# EAGLE design CameraSliderV1 (EAGLE 7.3.0)
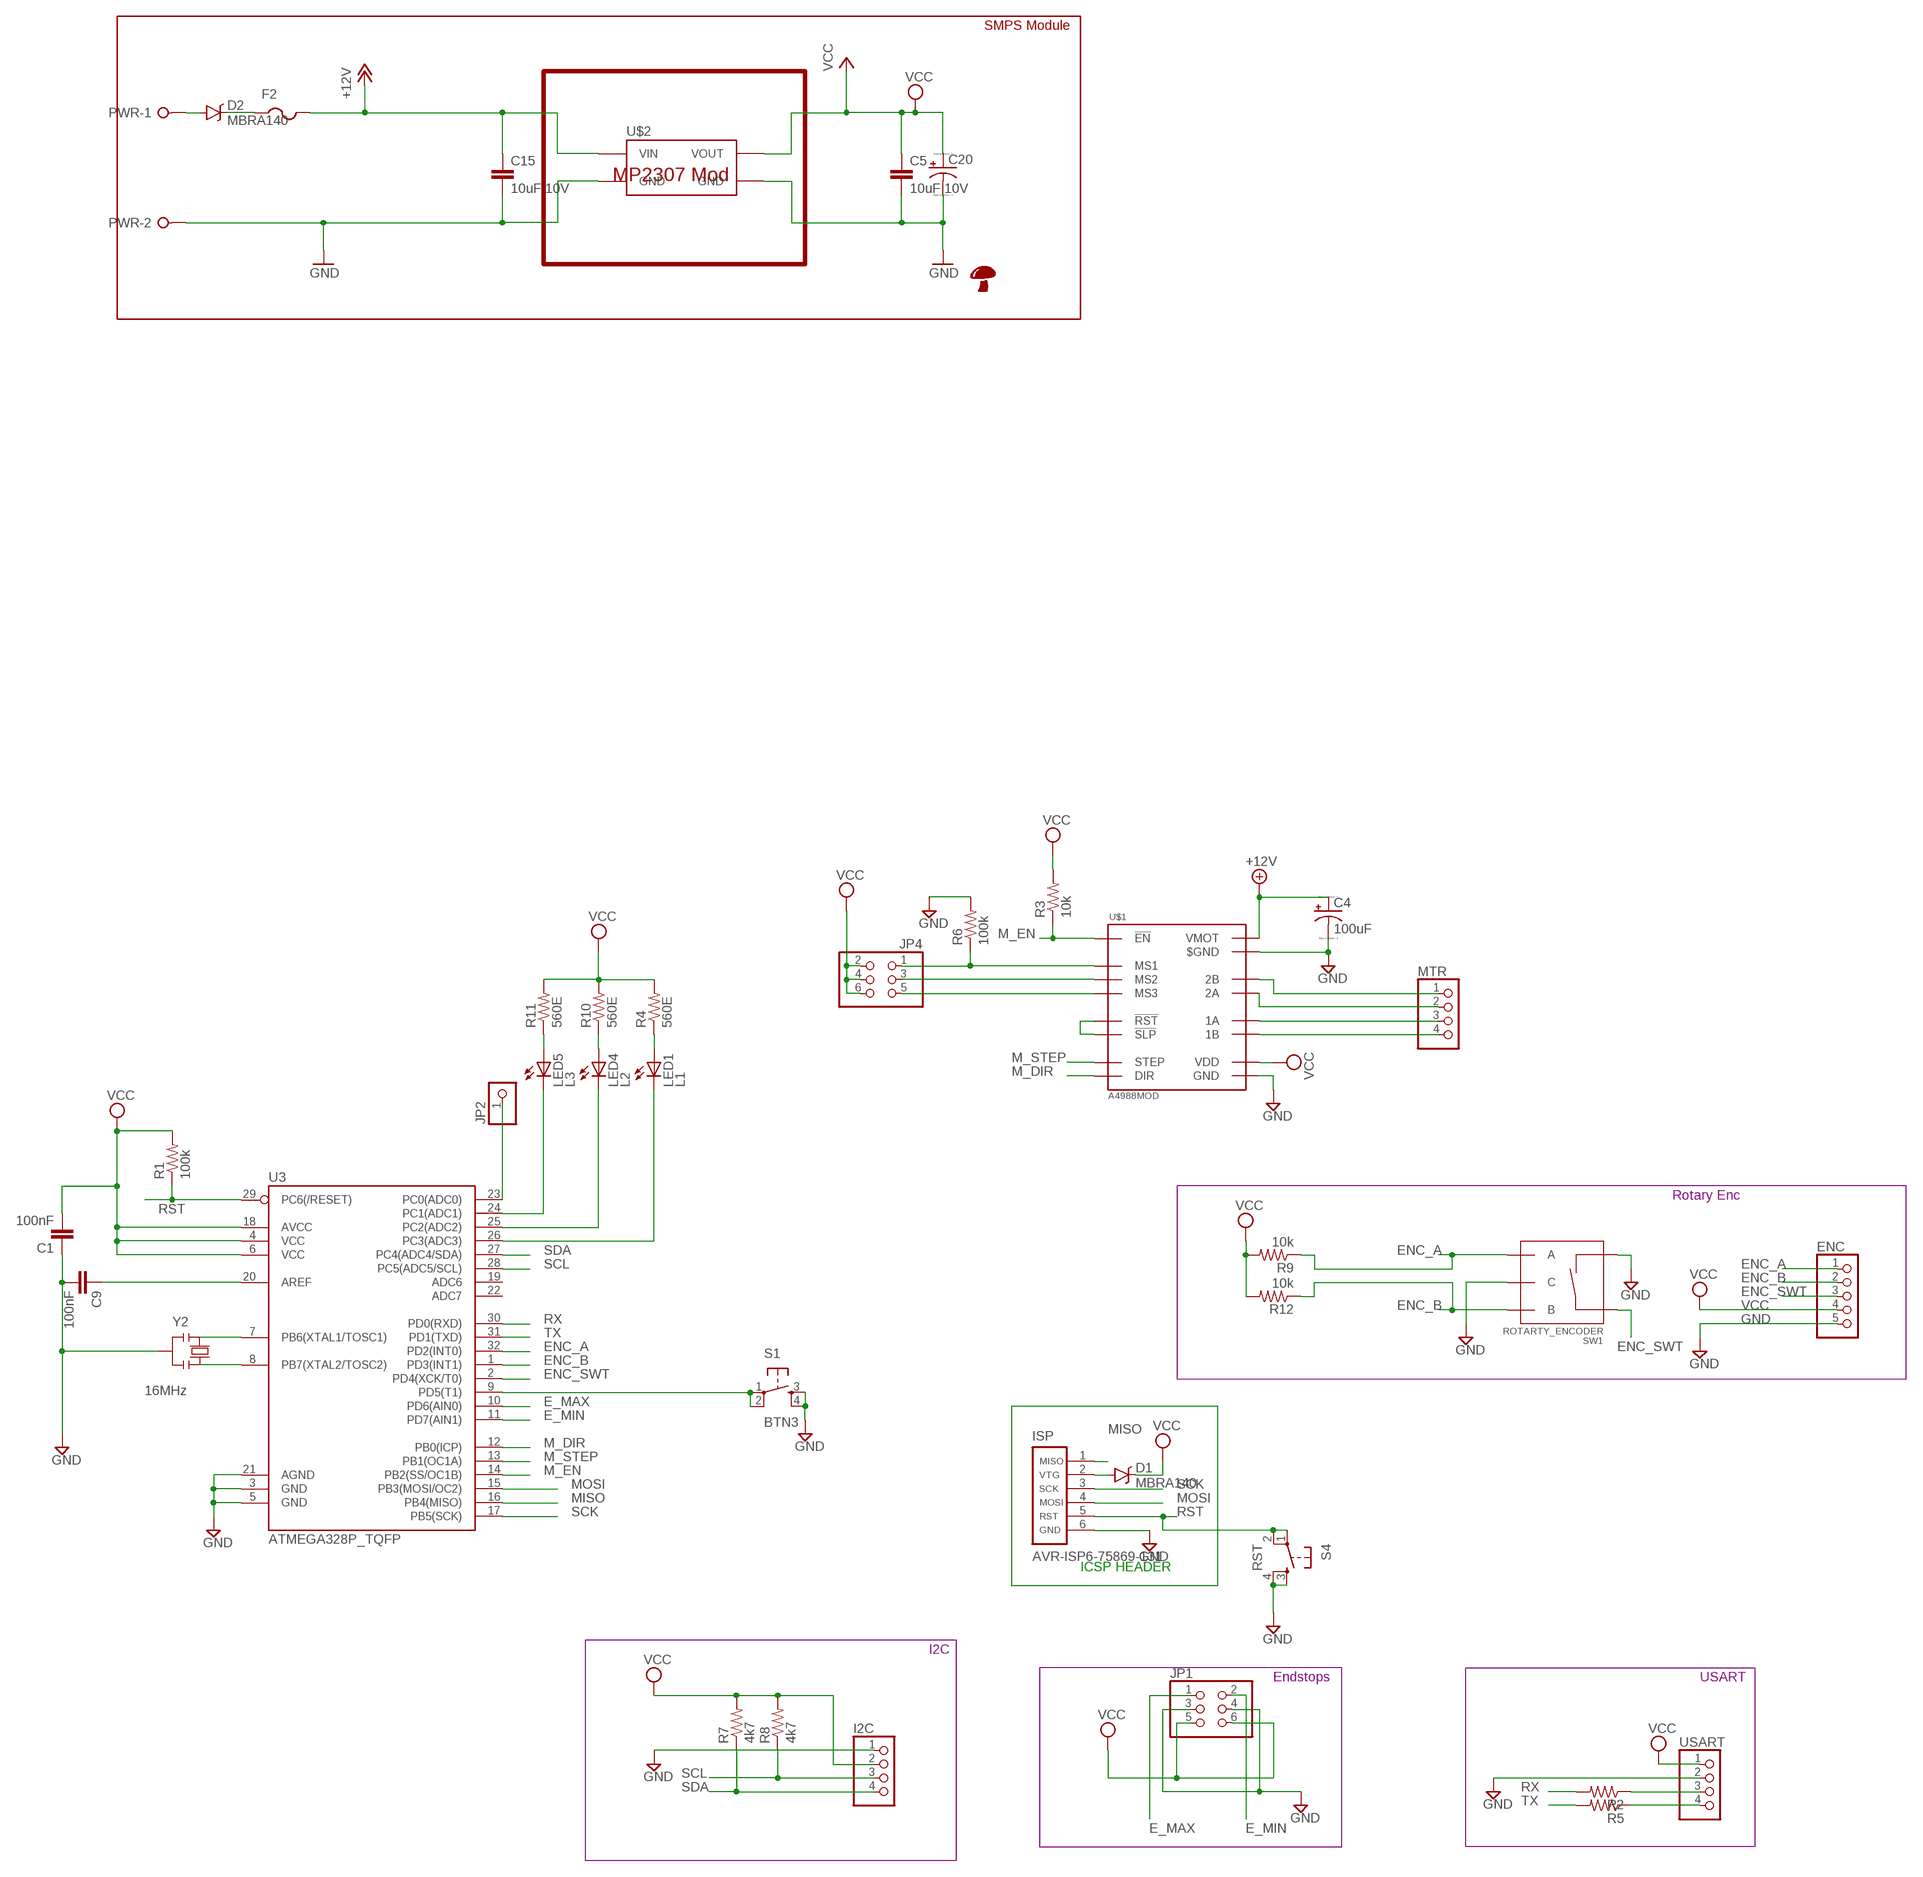
[diagram p0: schematic, sheet 1]

## Parts
C1  100nF  C-EUC0805  [C0805]
C4  100uF  CPOL-USD  [PANASONIC_D]
C5  10uF 10V  C-EUC0805  [C0805]
C9  100nF  C-EUC0805  [C0805]
C15  10uF 10V  C-EUC0805  [C0805]
C20  CPOL-USD  [PANASONIC_D]
D1  MBRA140  [SMA-DIODE]
D2  MBRA140  [SMA-DIODE]
ENC  PINHD-1X5  [1X05]
F2  PTCFUSE-1812  [1812]
I2C  PINHD-1X4  [1X04]
ISP  AVR-ISP6-75869-131  [HDR-75869-131]
JP1  PINHD-2X3  [2X03]
JP2  PINHD-1X1  [1X01]
JP4  PINHD-2X3  [2X03]
LED1  L1  LEDCHIP-LED0805  [CHIP-LED0805]
LED4  L2  LEDCHIP-LED0805  [CHIP-LED0805]
LED5  L3  LEDCHIP-LED0805  [CHIP-LED0805]
MTR  PINHD-1X4  [1X04]
PWR  W237-02P  [W237-132]
R1  100k  R-US_M0805  [M0805]
R2  R-US_M0805  [M0805]
R3  10k  R-US_M0805  [M0805]
R4  560E  R-US_M0805  [M0805]
R5  R-US_M0805  [M0805]
R6  100k  R-US_M0805  [M0805]
R7  4k7  R-US_M0805  [M0805]
R8  4k7  R-US_M0805  [M0805]
R9  10k  R-US_M0805  [M0805]
R10  560E  R-US_M0805  [M0805]
R11  560E  R-US_M0805  [M0805]
R12  10k  R-US_M0805  [M0805]
S1  BTN3  TAC_SWITCHSMD  [TACTILE_SWITCH_SMD]
S4  RST  TAC_SWITCHSMD  [TACTILE_SWITCH_SMD]
SW1  ROTARTY_ENCODER  [ROTARY_ENC_PLAIN]
U3  ATMEGA328P_TQFP  [TQFP32-08]
U$1  A4988MOD  [A4988MOD]
U$2  MP1584_MODULE  [D-SUN_MP1584]
U$15  SHROOM5MM  [SHROOM]
USART  PINHD-1X4  [1X04]
Y2  16MHz  RESONATORMU  [RESONATOR]

## Nets
+12V: C4.+ C15.1 F2.2 U$1.P$16(VMOT) U$2.P$5(VIN) U$2.P$6(VIN)
E_MAX: JP1.1 U3.10(PD6(AIN0))
E_MIN: JP1.2 U3.11(PD7(AIN1))
ENC_A: ENC.1 R9.1 SW1.A U3.32(PD2(INT0))
ENC_B: ENC.2 R12.1 SW1.B U3.1(PD3(INT1))
ENC_SWT: ENC.3 SW1.SW+ U3.2(PD4(XCK/T0))
GND: C1.1 C4.- C5.2 C9.2 C15.2 C20.- ENC.5 I2C.1 ISP.6 JP1.3 JP1.4 PWR.2 R6.2 S1.3 S1.4 S4.3 S4.4 SW1.C SW1.SW- U3.3(GND) U3.5(GND) U3.21(AGND) U$1.P$9(GND) U$1.P$15($GND) U$2.P$1(GND) U$2.P$2(GND) U$2.P$3(GND) U$2.P$4(GND) USART.2 Y2.2
M_DIR: U3.12(PB0(ICP)) U$1.P$8(DIR)
M_EN: R3.1 U3.14(PB2(SS/OC1B)) U$1.P$1(!EN)
M_STEP: U3.13(PB1(OC1A)) U$1.P$7(STEP)
MISO: ISP.1 U3.16(PB4(MISO))
MOSI: ISP.4 U3.15(PB3(MOSI/OC2))
N$1: LED1.A R4.1
N$2: D1.A ISP.2
N$3: LED5.C U3.24(PC1(ADC1))
N$4: JP4.1 R6.1 U$1.P$2(MS1)
N$5: U3.7(PB6(XTAL1/TOSC1)) Y2.1
N$6: U3.8(PB7(XTAL2/TOSC2)) Y2.3
N$7: LED4.A R10.1
N$8: LED5.A R11.1
N$9: LED4.C U3.25(PC2(ADC2))
N$10: LED1.C U3.26(PC3(ADC3))
N$11: S1.1 S1.2 U3.9(PD5(T1))
N$12: MTR.2 U$1.P$13(2A)
N$13: R2.1 USART.3
N$14: R5.1 USART.4
N$15: C9.1 U3.20(AREF)
N$16: MTR.1 U$1.P$14(2B)
N$17: MTR.3 U$1.P$12(1A)
N$18: MTR.4 U$1.P$11(1B)
N$19: JP4.3 U$1.P$3(MS2)
N$20: JP4.5 U$1.P$4(MS3)
N$21: U$1.P$5(!RST) U$1.P$6(!SLP)
N$22: D2.A PWR.1
N$23: JP2.1 U3.23(PC0(ADC0))
N$32: D2.C F2.1
RST: ISP.5 R1.1 S4.1 S4.2 U3.29(PC6(/RESET))
RX: R2.2 U3.30(PD0(RXD))
SCK: ISP.3 U3.17(PB5(SCK))
SCL: I2C.3 R8.1 U3.28(PC5(ADC5/SCL))
SDA: I2C.4 R7.1 U3.27(PC4(ADC4/SDA))
TX: R5.2 U3.31(PD1(TXD))
VCC: C1.2 C5.1 C20.+ D1.C ENC.4 I2C.2 JP1.5 JP1.6 JP4.2 JP4.4 JP4.6 R1.2 R3.2 R4.2 R7.2 R8.2 R9.2 R10.2 R11.2 R12.2 U3.4(VCC) U3.6(VCC) U3.18(AVCC) U$1.P$10(VDD) U$2.P$7(VOUT) U$2.P$8(VOUT) USART.1
Unconnected: U3.19(ADC6) U3.22(ADC7)

## Notes on the sheet
- SMPS Module
- MP2307 Mod
- Rotary Enc
- ICSP HEADER
- I2C
- Endstops | USART

## Library data of the parts
C1 C5 C9 C15 = resistor:C-EU: CAPACITOR, European symbol
C4 C20 = resistor:CPOL-US: POLARIZED CAPACITOR, American symbol
D1 D2 = SparkFun-DiscreteSemi:MBRA140: 40V, 1A Schottky rectifier SMA/DO-214AC package DIO-08053; PROD_ID: DIO-08053
ENC = pinhead:PINHD-1X5: PIN HEADER
F2 = adafruit:PTCFUSE: PTC fuses, resettable thermistors
I2C MTR USART = pinhead:PINHD-1X4: PIN HEADER
ISP = atmel-avr:AVR-ISP6-: AVR ISP-6 Serial Programming Header
JP1 JP4 = pinhead:PINHD-2X3: PIN HEADER
JP2 = pinhead:PINHD-1X1: PIN HEADER
LED1 LED4 LED5 = led:LED: LED OSRAM: - CHIPLED LG R971, LG N971, LY N971, LG Q971, LY Q971, LO R971, LY R971 LH N974, LH R974 LS Q976, LO Q976, LY Q976 LO Q996 - Hyper CHIPLED LW Q18S LB Q993, LB Q99A, LB R99A - SideLED LS A670, LO A670, LY A670, LG A670, LP A670 LB A673, LV A673, LT A673, LW A673 LH A674 LY A675 LS A676, LA A676, LO A676, LY A676, LW A676 LS A679, LY A679, LG A679 - Hyper Micro SIDELED® LS Y876, LA Y876, LO Y876, LY Y876 LT Y87S - SmartLED LW L88C, LW L88S LB L89C, LB L89S, LG L890 LS L89K, LO L89K, LY L89K LS L896, LA L896, LO L896, LY L896 - TOPLED LS T670, LO T670, LY T670, LG T670, LP T670 LSG T670, LSP T670, LSY T670, LOP T670, LYG T670 LG T671, LOG T671, LSG T671 LB T673, LV T673, LT T673, LW T673 LH T674 LS T676, LA T676, LO T676, LY T676, LB T676, LH T676, LSB T676, LW T676 LB T67C, LV T67C, LT T67C, LS T67K, LO T67K, LY T67K, LW E67C LS E67B, LA E67B, LO E67B, LY E67B, LB E67C, LV E67C, LT E67C LW T67C LS T679, LY T679, LG T679 LS T770, LO T770, LY T770, LG T770, LP T770 LB T773, LV T773, LT T773, LW T773 LH T774 LS E675, LA E675, LY E675, LS T675 LS T776, LA T776, LO T776, LY T776, LB T776 LHGB T686 LT T68C, LB T68C - Hyper Mini TOPLED® LB M676 - Mini TOPLED Santana® LG M470 LS M47K, LO M47K, LY M47K Source: http://www.osram.convergy.de LUXEON: - LUMILED® LXK2-PW12-R00, LXK2-PW12-S00, LXK2-PW14-U00, LXK2-PW14-V00 LXK2-PM12-R00, LXK2-PM12-S00, LXK2-PM14-U00 LXK2-PE12-Q00, LXK2-PE12-R00, LXK2-PE12-S00, LXK2-PE14-T00, LXK2-PE14-U00 LXK2-PB12-K00, LXK2-PB12-L00, LXK2-PB12-M00, LXK2-PB14-N00, LXK2-PB14-P00, LXK2-PB14-Q00 LXK2-PR12-L00, LXK2-PR12-M00, LXK2-PR14-Q00, LXK2-PR14-R00 LXK2-PD12-Q00, LXK2-PD12-R00, LXK2-PD12-S00 LXK2-PH12-R00, LXK2-PH12-S00 LXK2-PL12-P00, LXK2-PL12-Q00, LXK2-PL12-R00 Source: www.luxeon.com KINGBRIGHT: KA-3528ASYC Source: www.kingbright.com
PWR = con-wago-508:W237-02P: WAGO SREW CLAMP; OC_FARNELL: unknown; OC_NEWARK: unknown
R1-R12 = resistor:R-US_: RESISTOR, American symbol
S1 S4 = SparkFun:TAC_SWITCH: Momentary Switch Button commonly used for reset or general input. Spark Fun Electronics SKU : COM-00097
SW1 = SparkFun-Electromechanical:ROTARTY_ENCODER: Simple no LED rotary encoder Example: COM-09117
U3 = SparkFun-DigitalIC:ATMEGA328P_TQFP; PROD_ID: IC-09069
U$1 = RobThePyro:A4988MOD
U$2 = RobThePyro:MP1584_MODULE: SMPS Module D-SUN MP1584 http://www.haoyuelectronics.com/Attachment/MP1584/MP1584_3.jpg
U$15 = RobThePyro:SHROOM
Y2 = SmartPrj:RESONATOR

## Board
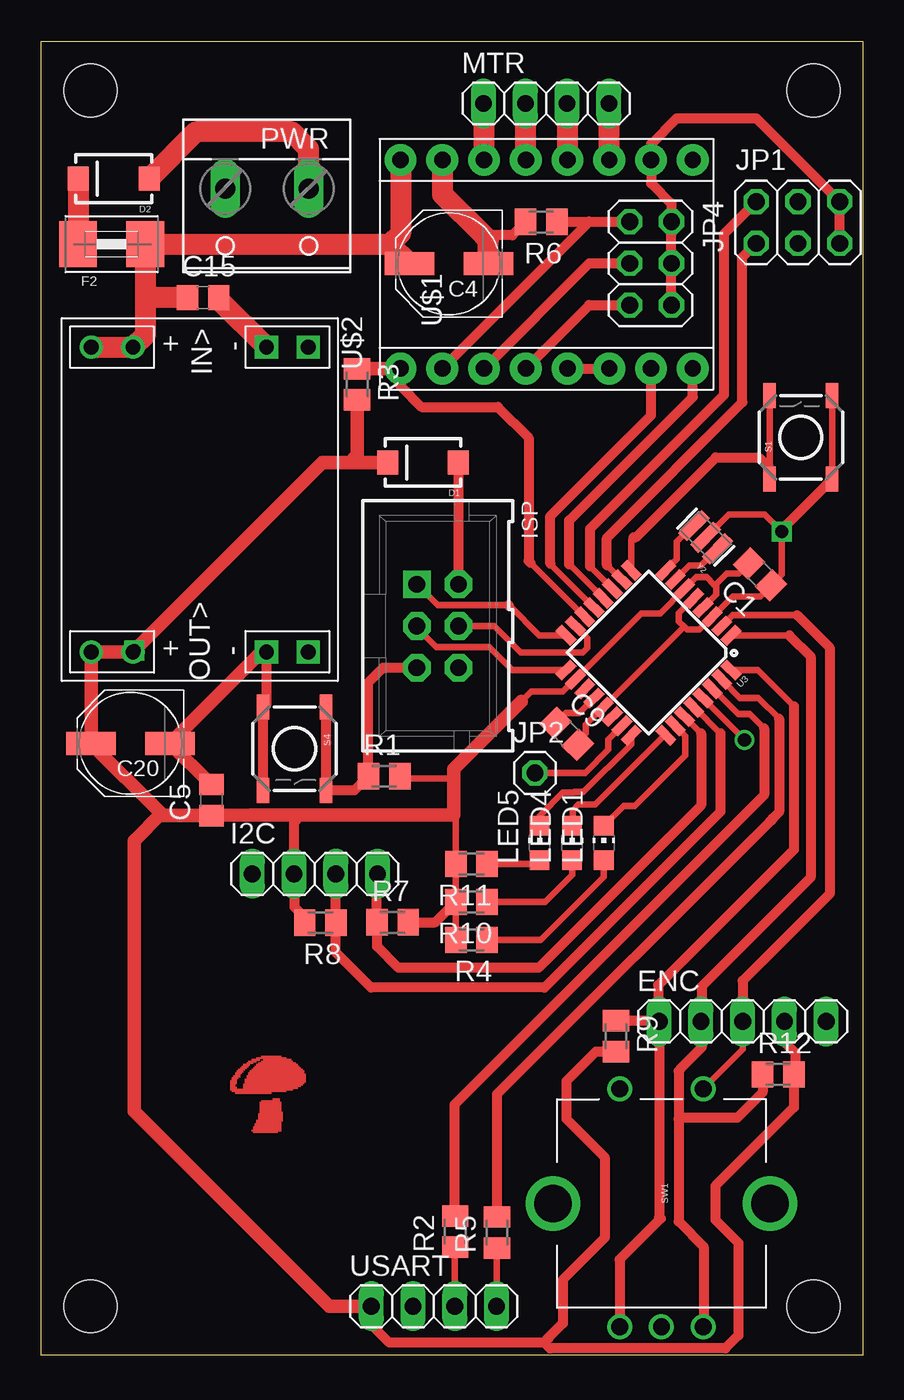
[diagram p1: board, top side]
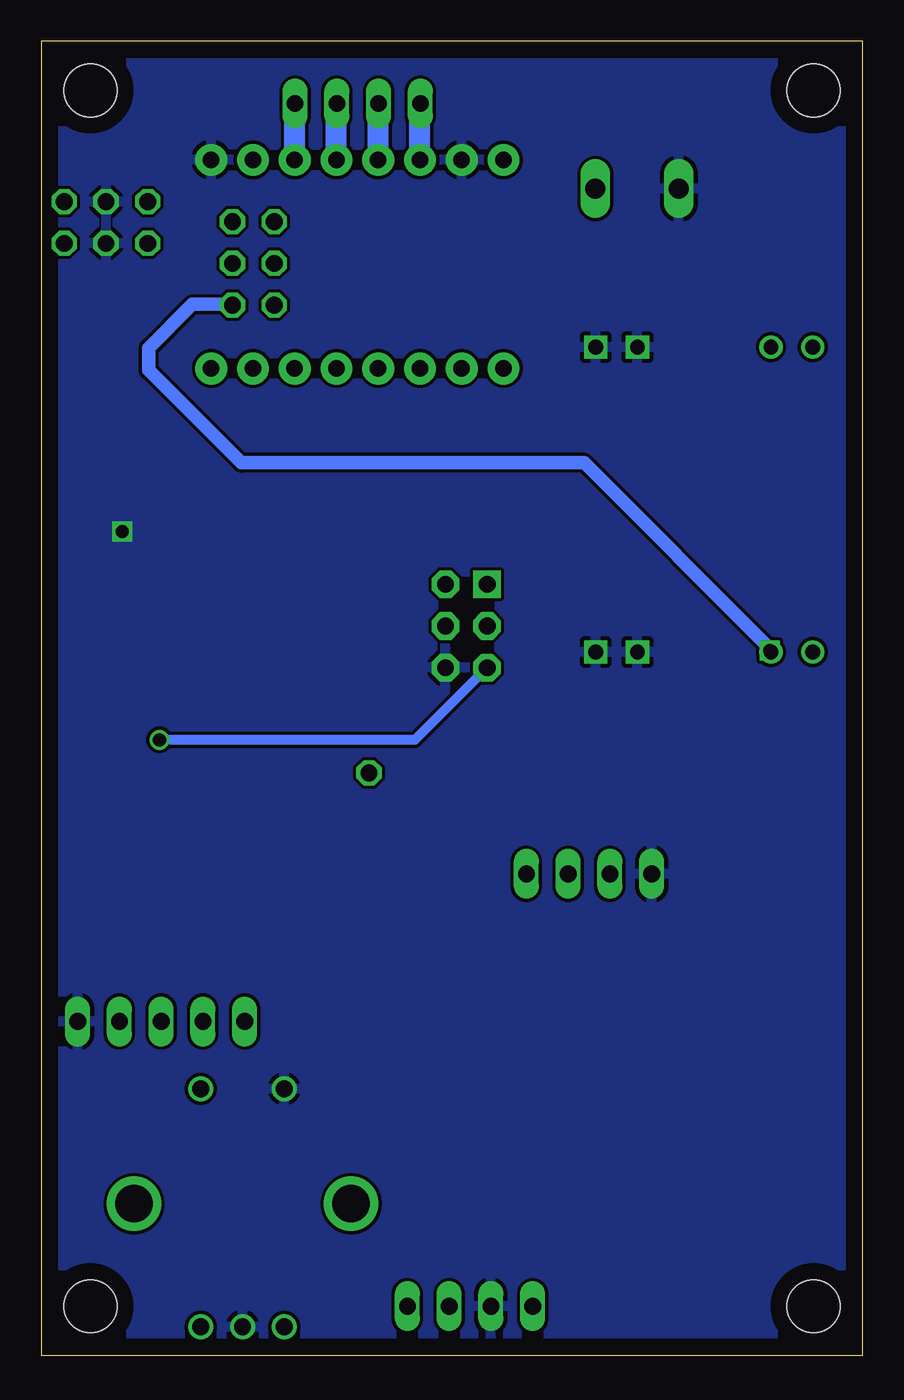
[diagram p2: board, bottom side, seen from below]

Size 50 x 80 mm. Coordinates in mm from the lower left corner, seen from the top.
Outline: 0,0 0,80 50,80 50,0 0,0
Copper layers (1*16): Top 0.035mm / dielectric 1.5mm / Bottom 0.035mm
Design rules "default": minimum track width 10mil, minimum drill 24mil, track to track 8mil, track to pad 8mil, pad to pad 8mil, via to via 8mil, smd to smd 8mil, copper to edge 40mil, drill to drill 8mil, minimum pad ring 10mil, minimum via ring 8mil, stop-mask expansion 4mil, vias tented up to drill 0mil, thermal gap 10mil
Holes 3.2 mm at 3,3 3,77 47,77 47,3

### Footprints (pad centres in the part's own frame; a part is rotated, then mirrored left to right if it is on the bottom)
C0805 = smd 1.3 x 1.5: 1 -0.95,0; 2 0.95,0
PANASONIC_D = smd 3 x 1.4: + 2.4,0; - -2.4,0
SMA-DIODE = smd 1.27 x 1.47: A -2.15,0; C 2.15,0
1X05 = drill 1.016 long: 1 -5.08,0; 2 -2.54,0; 3 0,0; 4 2.54,0; 5 5.08,0
1812 = smd 2.286 x 2.794: 1 -2.046,0; 2 2.046,0
1X04 = drill 1.016 long: 1 -3.81,0; 2 -1.27,0; 3 1.27,0; 4 3.81,0
HDR-75869-131 = drill 1.016 pad 1.676 square: 1 -2.54,-1.27 | drill 1.016 pad 1.676 octagon: 2 -2.54,1.27; 3 0,-1.27; 4 0,1.27; 5 2.54,-1.27; 6 2.54,1.27
2X03 = drill 1.016 octagon: 1 -2.54,-1.27; 2 -2.54,1.27; 3 0,-1.27; 4 0,1.27; 5 2.54,-1.27; 6 2.54,1.27
1X01 = drill 1.016 octagon: 1 0,0
CHIP-LED0805 = smd 1.2 x 1.2: A 0,-1.05; C 0,1.05
W237-132 = drill 1.194 long: 1 -2.54,-0.635; 2 2.54,-0.635
M0805 = smd 1.3 x 1.6: 1 -0.95,0; 2 0.95,0
TACTILE_SWITCH_SMD = smd 1.524 x 0.762: 1 -2.54,1.905; 2 2.54,1.905; 3 -2.54,-1.905; 4 2.54,-1.905
ROTARY_ENC_PLAIN = drill 1.016: A 7.493,-2.54; B 7.493,2.54; C 7.493,0; SW+ -6.985,2.54; SW- -6.985,-2.54 | drill 2.286: P$3 0,6.604; P$4 0,-6.604
TQFP32-08 = smd 1.27 x 0.559: 1 -4.293,2.8; 2 -4.293,2; 3 -4.293,1.2; 4 -4.293,0.4; 5 -4.293,-0.4; 6 -4.293,-1.2; 7 -4.293,-2; 8 -4.293,-2.8; 17 4.293,-2.8; 18 4.293,-2; 19 4.293,-1.2; 20 4.293,-0.4; 21 4.293,0.4; 22 4.293,1.2; 23 4.293,2; 24 4.293,2.8 | smd 0.559 x 1.27: 9 -2.8,-4.293; 10 -2,-4.293; 11 -1.2,-4.293; 12 -0.4,-4.293; 13 0.4,-4.293; 14 1.2,-4.293; 15 2,-4.293; 16 2.8,-4.293; 25 2.8,4.293; 26 2,4.293; 27 1.2,4.293; 28 0.4,4.293; 29 -0.4,4.293; 30 -1.2,4.293; 31 -2,4.293; 32 -2.8,4.293
A4988MOD = drill 1 pad 1.93: P$1 -6.35,8.89; P$2 -6.35,6.35; P$3 -6.35,3.81; P$4 -6.35,1.27; P$5 -6.35,-1.27; P$6 -6.35,-3.81; P$7 -6.35,-6.35; P$8 -6.35,-8.89; P$9 6.35,-8.89; P$10 6.35,-6.35; P$11 6.35,-3.81; P$12 6.35,-1.27; P$13 6.35,1.27; P$14 6.35,3.81; P$15 6.35,6.35; P$16 6.35,8.89
D-SUN_MP1584 = drill 0.9 square: P$1 -9.271,6.604; P$2 -9.271,4.064; P$3 9.271,6.604; P$4 9.271,4.064 | drill 0.9: P$5 -9.271,-6.604; P$6 -9.271,-4.064; P$7 9.271,-6.604; P$8 9.271,-4.064
RESONATOR = smd 0.7 x 2: 1 -1,0; 2 0,0; 3 1,0

### Placement (x,y rotation side)
C1  43.74,47.55 135 top
C4  24.82,66.45 180 top
C5  10.36,33.81 90 top
C9  31.98,37.85 315 top
C15  9.86,64.39 0 top
C20  5.44,37.26 180 top
D1  23.24,54.36 180 top
D2  4.42,71.63 180 top
ENC  42.69,20.33 0 top
F2  4.29,67.64 0 top
I2C  16.66,29.31 0 top
ISP  24.13,44.4 270 top
JP1  46.05,68.96 0 top
JP2  30.05,35.46 0 top
JP4  37.08,66.47 270 top
LED1  34.24,31.19 0 top
LED4  32.31,31.19 0 top
LED5  30.33,31.19 0 top
MTR  30.73,76.2 0 top
PWR  13.74,70.38 180 top
R1  20.88,35.26 0 top
R2  25.2,7.54 90 top
R3  19.23,59.11 270 top
R4  26.19,25.3 180 top
R5  27.74,7.49 90 top
R6  30.43,68.99 180 top
R7  21.39,26.37 0 top
R8  16.99,26.34 180 top
R9  34.98,19.43 270 top
R10  26.19,27.61 180 top
R11  26.19,29.92 180 top
R12  44.85,17.11 0 top
S1  46.23,55.88 90 top
S4  15.42,36.93 270 top
SW1  37.74,9.25 270 top
U3  36.96,42.77 225 top
U$1  30.76,66.42 90 top
U$2  9.65,52.1 270 top
U$15  11.46,13.59 0 top
USART  23.9,3 0 top
Y2  40.44,49.8 135 top

### Tracks (layer width: path | path; a pad name or v marks a point on that pad's centre or on a via)
+12V
  Top 1.27: 6.34,64.31 F2.2 21.22,67.64 | 6.34,64.31 6.34,62.12 U$2.P$6 U$2.P$5 | 21.22,67.64 C4.+ | U$1.P$16 21.87,68.29 21.22,67.64 | C15.1 6.42,64.39 6.34,64.31
E_MAX
  Top 0.406: U3.10 35.3,47.22 34.42,48.11
  Top 0.61: 34.42,48.11 34.42,49.76 42.67,58.01 42.67,66.85 JP1.1
E_MIN
  Top 0.406: U3.11 33.4,48.03
  Top 0.61: 33.4,48.03 33.4,50.32 41.55,58.47 41.55,68.28 JP1.2
ENC_A
  Top 0.406: 37.54,20.4 ENC.1 | 37.61,8.44 37.71,8.34 | U3.32 43.6,41.72 45.8,39.52
  Top 0.61: 37.54,20.4 37.54,22.53 45.8,30.79 45.8,39.52 | 37.71,8.34 35.2,5.84 SW1.A | 37.61,8.44 ENC.1 37.56,20.39 R9.1
ENC_B
  Top 0.406: U3.1 45.53,43.83 | 40.18,20.36 ENC.2
  Top 0.61: 45.53,43.83 46.81,42.55 46.81,29.08 40.18,22.45 40.18,20.36 40.18,18.75 38.91,17.48 38.91,17.45 38.79,17.32 38.79,14.38 | 38.79,14.38 38.79,8.15 40.31,6.63 40.31,1.78 SW1.B | R12.1 43.9,16.01 42.37,14.48 38.89,14.48 38.79,14.38
ENC_SWT
  Top 0.406: U3.2 42.07,45.06 46,45.06 | ENC.3 42.69,18.64 SW1.SW+
  Top 0.61: 46,45.06 47.98,43.08 47.98,28.09 42.69,22.8 ENC.3
GND  (via drill 0.8)
  Top 0.406: U3.5 38.81,45.19 38.81,44.68 39.13,44.36 | 39.13,44.36 39.32,44.17 40.06,44.17 U3.3 42.08,46.2 43.76,46.2 44.41,46.85 C1.1 45.06,47.53 v45.06,50.14 44.02,51.18 41.83,51.18 40.46,49.8 Y2.2 | C9.2 32.65,37.35 33.15,37.85 33.15,38.4 U3.21 34.22,39.45 39.13,44.36 | S1.4 S1.3
  Top 0.61: R6.2 28.67,68.17 26.92,68.17 | S4.3 13.72,39.67 13.72,40.01 | 13.72,40.01 U$2.P$4 | v45.06,50.14 45.06,50.27 S1.3 | S4.4 13.51,39.8 13.72,40.01
  Top 0.813: U$2.P$4 13.4,42.82 C20.- 10.34,34.76 C5.2
  Top 1.27: C15.2 10.8,64.28 U$2.P$2 | C4.- 27.22,67.88 26.92,68.17 24.43,70.66 24.43,72.75 U$1.P$15
  pour Bottom: 0,0 50,0 50,80 0,80
M_DIR
  Top 0.406: U3.12 32.13,48.16
  Top 0.61: 32.13,48.16 32.13,50.83 39.65,58.34 U$1.P$8
M_EN
  Top 0.406: 29.77,48.26 U3.14
  Top 0.61: U$1.P$1 21.87,59 23.14,57.73 27.79,57.73 29.67,55.85 29.67,48.36 29.77,48.26
  Top 0.813: U$1.P$1 19.24,60.07 R3.1
M_STEP
  Top 0.406: U3.13 30.99,48.18
  Top 0.61: 30.99,48.18 30.99,51.1 37.11,57.23 U$1.P$7
MISO
  Top 0.406: U3.16 30.31,43.83 28.5,45.64 28.47,45.64 | 28.45,45.67 24.13,45.67 ISP.1
  Top 0.61: 28.47,45.64 28.45,45.67
MOSI
  Top 0.406: U3.15 33.22,43.68 33.22,43.05 32.94,42.77 29.18,42.77 27.56,44.4 ISP.4
N$1
  Top 0.406: R4.1 30.4,25.3 34.24,29.13 LED1.A
N$2
  Top 0.61: ISP.2 25.4,54.35 D1.A
N$3
  Top 0.406: LED5.C 30.33,32.84 31.75,34.27 32.41,34.27 32.43,34.29 32.99,34.29 35.9,37.2 U3.24
N$4
  Top 0.61: U$1.P$2 33.33,68.99 | JP4.1 33.35,69.01 33.33,68.99 | 33.33,68.99 R6.1
N$5
  Top 0.406: U3.7 39.44,48.08 40.13,48.08 Y2.1
N$6
  Top 0.406: U3.8 38.68,48.46 38.68,49.53 39.67,50.51 Y2.3
N$7
  Top 0.406: R10.1 30.68,27.61 32.31,29.23 LED4.A
N$8
  Top 0.406: R11.1 30.11,29.92 LED5.A
N$9
  Top 0.406: U3.25 37.94,37.76 33.71,33.53 32.69,33.53 32.33,33.17 32.33,32.27 LED4.C
N$10
  Top 0.406: U3.26 39.19,37.72 39.19,36.52 36.12,33.45 35.45,33.45 LED1.C
N$11
  Top 0.406: S1.1 44.32,54 S1.2 | U3.9 35.9,49.64 36.04,49.78
  Top 0.61: 36.04,49.78 36.17,49.78 41.05,54.66 43.66,54.66 44.32,54
N$12
  Top 1.27: MTR.2 29.46,72.8 U$1.P$13
  Bottom 1.27: U$1.P$13 29.49,76.12
N$13
  Top 0.406: USART.3 25.17,6.57 R2.1
N$14
  Top 0.406: R5.1 27.74,3.02 USART.4
N$15
  Top 0.406: U3.20 32.73,39.12 31.93,39.12 31.33,38.52 C9.1
N$16
  Top 1.27: MTR.1 26.92,72.8 U$1.P$14
  Bottom 1.27: U$1.P$14 26.95,76.17 MTR.1
N$17
  Top 1.27: MTR.3 32,72.8 U$1.P$12
  Bottom 1.27: U$1.P$12 32.03,76.17
N$18
  Top 1.27: MTR.4 34.54,72.8 U$1.P$11
  Bottom 1.27: U$1.P$11 34.57,76.17 MTR.4
N$19
  Top 0.61: U$1.P$3 33.35,66.47 JP4.3
N$20
  Top 0.61: U$1.P$4 33.35,63.93 JP4.5
N$21
  Top 0.61: U$1.P$5 U$1.P$6
N$22
  Top 1.27: 6.62,71.68 D2.A 9.41,74.47 15.24,74.47 16.28,73.43 PWR.1
N$23
  Top 0.406: U3.23 35.34,38.31 34.52,37.49 34.52,36.88 33.1,35.46 JP2.1
N$32
  Top 1.27: D2.C 2.27,67.66 F2.1
RST  (via drill 0.8)
  Top 0.406: U3.29 40.27,39.99 v42.8,37.47
  Top 0.61: ISP.5 20.8,41.86 19.91,40.97 19.91,35.27 R1.1 19.07,34.39 S4.2 S4.1
  Bottom 0.61: ISP.5 27.25,37.47 v42.8,37.47
RX
  Top 0.406: 25.15,8.54 R2.2 | U3.30 40.87,40.59 42.42,39.04 43.13,39.04 43.99,38.18
  Top 0.61: 25.15,8.54 25.15,15.27 43.99,34.11 43.99,38.18
SCK
  Top 0.406: ISP.3 22.86,44.3 24.03,43.13 27.28,43.13 28.68,41.73 31.93,41.73 U3.17
SCL
  Top 0.406: U3.28 39.74,39.45 41.33,37.87
  Top 0.61: 41.33,37.87 41.33,33.1 30.63,22.4 20.07,22.4 17.93,24.54 R8.1 17.94,29.3 I2C.3
SDA
  Top 0.406: U3.27 40.16,37.87
  Top 0.61: 40.16,37.87 40.16,33.48 30.28,23.6 21.74,23.6 20.45,24.89 20.45,26.36 R7.1 20.44,29.28 I2C.4
TX
  Top 0.406: U3.31 41.47,41.15 41.47,41.08 42.52,40.03 43.64,40.03 44.91,38.76
  Top 0.61: R5.2 27.74,15.9 44.35,32.51 44.55,32.72 44.91,33.07 44.91,38.76
VCC  (via drill 0.8)
  Top 0.406: 40.93,46.93 40.49,47.37 39.86,47.37 U3.6 39.14,46.64 37.67,45.16 36.52,45.16 U3.18 32.49,41.15 31.75,40.41 29.82,40.41 29.21,39.8 | 40.93,46.93 41.07,46.79 41.07,46.33 U3.4 | C1.2 42.45,47.6 41.71,47.6 41.03,46.93 40.93,46.93 | R4.2 R10.2 R11.2 25.24,32.78 25.12,32.89 | R1.2 21.96,35.13 25.12,35.13 | 9.86,32.58 9.58,32.86
  Top 0.61: JP4.6 JP4.4 JP4.2 38.35,70.1 37.11,71.35 U$1.P$10 37.11,73.74 38.66,75.29 43.54,75.29 JP1.6 JP1.5 | R9.2 33.75,18.48 31.95,16.69 31.95,14.4 34.29,12.06 34.29,7.16 31.75,4.62 31.75,1.96 30.86,1.07 30.86,1.04 30.61,0.79 | 30.61,0.79 21.18,0.79 20.07,1.91 20.07,2.97 USART.1 | ENC.4 45.23,19.08 45.9,18.41 45.9,17.21 R12.2 45.8,15.09 41.02,10.31 41.02,8.26 42.42,6.86 42.42,1.22 41.63,0.43 30.96,0.43 30.61,0.79 | R8.2 16.04,26.66 15.42,27.28 15.42,29.29 I2C.2 15.39,32.49 15.8,32.89 | R7.2 23.99,26.36 R10.2
  Top 0.813: D1.C 18.8,54.36 | 18.8,54.36 17.12,54.36 v5.66,42.9 U$2.P$8 U$2.P$7 3.05,37.27 C20.+ 7.32,32.98 | R3.2 19.23,54.79 18.8,54.36 | 10.03,32.86 C5.1 | C5.1 12.76,32.89 15.8,32.89 25.12,32.89 25.12,35.13 25.12,35.71 29.21,39.8 | 7.32,32.98 7.44,32.86 9.58,32.86 C5.1 | USART.1 17.53,3 5.66,14.86 5.66,31.32 7.32,32.98
  Bottom 0.813: v5.66,42.9 5.66,43.03 16.97,54.33 37.82,54.33 43.46,59.97 43.46,61.32 40.79,63.98 38.41,63.98 JP4.6